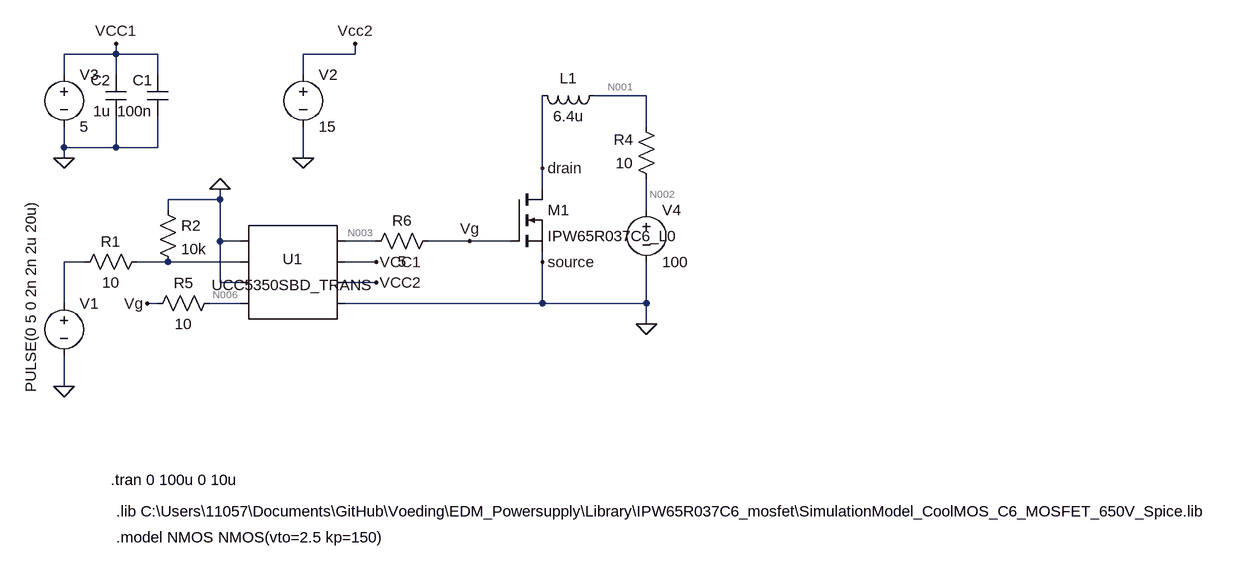
[diagram p0: schematic EDM_Powersupply_V2.asc]
* EDM_Powersupply_V2.asc
* U1: UCC5350SBD_TRANS (symbol AutoGenerated\UCC5350SBD_TRANS not available, pins judged from their places): pin1=0 pin2=N005 pin3=0 pin4=N006 pin5=N003 pin6=VCC1 pin7=VCC2 pin8=0
V1 N004 0 PULSE(0 5 0 2n 2n 2u 20u)
V2 VCC2 0 15
C1 0 VCC1 100n
C2 0 VCC1 1u
V3 VCC1 0 5
R1 N005 N004 10
R2 0 N005 10k
R4 N002 N001 10
V4 N002 0 100
R5 N006 Vg 10
R6 Vg N003 5
XM1 drain Vg 0 IPW65R037C6_L0  ; pins D G S
L1 N001 drain 6.4u
.lib C:\Users\11057\Documents\GitHub\Voeding\EDM_Powersupply\Library\IPW65R037C6_mosfet\SimulationModel_CoolMOS_C6_MOSFET_650V_Spice.lib
.tran 0 100u 0 10u
.model NMOS NMOS(vto=2.5 kp=150)
.backanno
.end

* Results of the author's LTspice run, read from the files saved beside the schematic
* Operating Point, zero values left out:
*   V(vcc2) = 15 V
*   V(n006) = 53.04 µV
*   V(vcc1) = 5 V
*   V(n003) = 3.034 µV
*   V(n002) = 100 V
*   V(n001) = 100 V
*   V(vg) = 53.04 µV
*   V(drain) = 100 V
*   I(L1) = 10 µA
*   I(R6) = 10 µA
*   I(R5) = 90.04 pA
*   I(R4) = 10 µA
*   I(V4) = -10 µA
*   I(V3) = -40.01 µA
*   I(V2) = -15.11 nA
*   Ix(u1:GND1) = -5 nA
*   Ix(u1:IN-) = -40 µA
*   Ix(u1:OUTH) = -90.04 pA
*   Ix(u1:OUTL) = 10 µA
*   Ix(u1:VCC1) = 40.01 µA
*   Ix(u1:VCC2) = 15.11 nA
*   Ix(u1:VEE2) = -10.02 µA
*   Ix(m1:DRAIN) = 10 µA
*   Ix(m1:GATE) = -10 µA
*   Ix(m1:SOURCE) = -416.8 pA
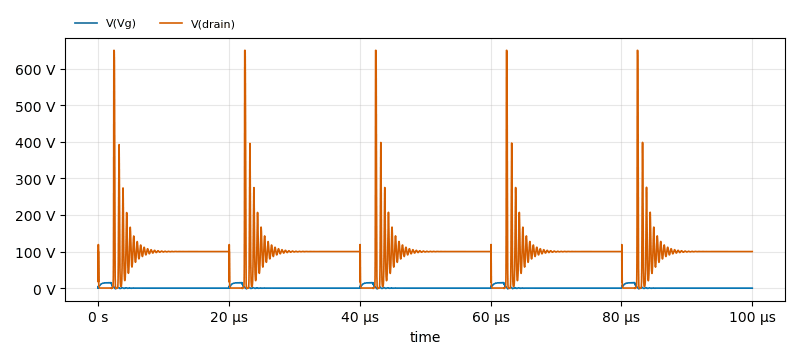
[diagram p1: Transient Analysis of EDM_Powersupply_V2.asc, plotted from the saved traces]
* Transient Analysis, 1 run:
*   V(Vg): min -1.834 V, max 15.03 V, average 1.379 V, rms 4.22 V, last 49.12 µV
*   V(drain): min -1.157 V, max 650.1 V, average 91.65 V, rms 112 V, last 100 V